# Altium schematic sheet MainSheet.SchDoc
size A; SheetNumber: 1; SheetTotal: 5
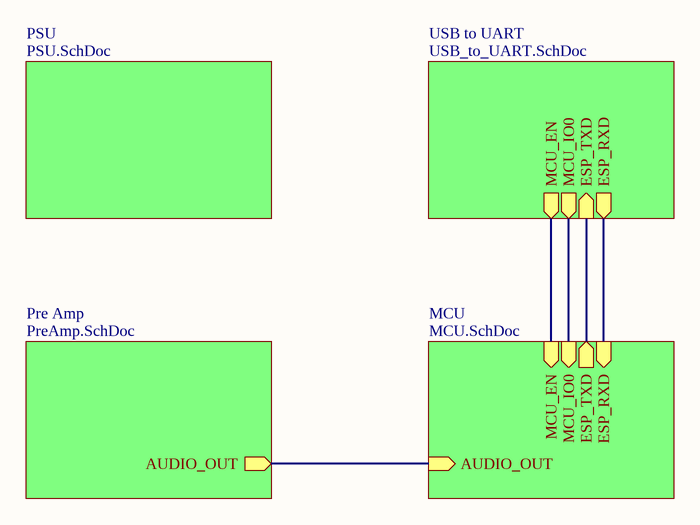
[diagram p0: MainSheet.SchDoc]

## Sub-sheets
MCU = MCU.SchDoc: ESP_TXD (out), ESP_RXD (in), MCU_EN (in), MCU_IO0 (in), AUDIO_OUT (in)
Pre Amp = PreAmp.SchDoc: AUDIO_OUT (out)
PSU = PSU.SchDoc: no entries
USB to UART = USB_to_UART.SchDoc: ESP_TXD (in), ESP_RXD (out), MCU_IO0 (out), MCU_EN (out)

## Nets
(unnamed): sheet Pre Amp/AUDIO_OUT, sheet MCU/AUDIO_OUT
(unnamed): sheet MCU/ESP_TXD, sheet USB to UART/ESP_TXD
(unnamed): sheet MCU/ESP_RXD, sheet USB to UART/ESP_RXD
(unnamed): sheet MCU/MCU_EN, sheet USB to UART/MCU_EN
(unnamed): sheet MCU/MCU_IO0, sheet USB to UART/MCU_IO0